# EAGLE design USB_JoystickKeyboarMouse (EAGLE 9.6.2)
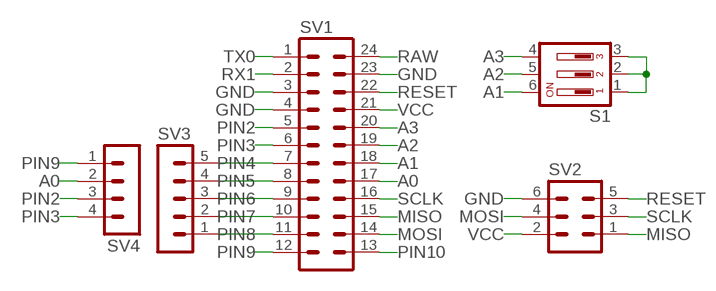
[diagram p0: schematic, sheet 1]

## Parts
S1  DIP03YL  [DIP03YL]
SV1  IC24P  [IC24P]
SV2  MA03-2  [MA03-2]
SV3  MA05-1  [MA05-1]
SV4  MA04-1  [MA04-1]

## Nets
A0: SV1.17 SV4.2
A1: S1.6 SV1.18
A2: S1.5 SV1.19
A3: S1.4 SV1.20
GND: S1.1 S1.2 S1.3 SV1.3 SV1.4 SV1.23 SV2.6
MISO: SV1.15 SV2.1
MOSI: SV1.14 SV2.4
PIN2: SV1.5 SV4.3
PIN3: SV1.6 SV4.4
PIN4: SV1.7 SV3.5
PIN5: SV1.8 SV3.4
PIN6: SV1.9 SV3.3
PIN7: SV1.10 SV3.2
PIN8: SV1.11 SV3.1
PIN9: SV1.12 SV4.1
PIN10: SV1.13
RAW: SV1.24
RESET: SV1.22 SV2.5
RX1: SV1.2
SCLK: SV1.16 SV2.3
TX0: SV1.1
VCC: SV1.21 SV2.2

## Library data of the parts
S1 = switch-dil:DIP03YL: DIL/CODE SWITCH; OC_FARNELL: unknown; OC_NEWARK: unknown
SV1 = con-dil:IC24P: DIL CABLE CONNECTOR
SV2 = con-lstb:MA03-2: PIN HEADER; OC_FARNELL: unknown; OC_NEWARK: unknown
SV3 = con-lstb:MA05-1: PIN HEADER; OC_FARNELL: unknown; OC_NEWARK: unknown
SV4 = con-lstb:MA04-1: PIN HEADER; OC_FARNELL: unknown; OC_NEWARK: unknown

## Board
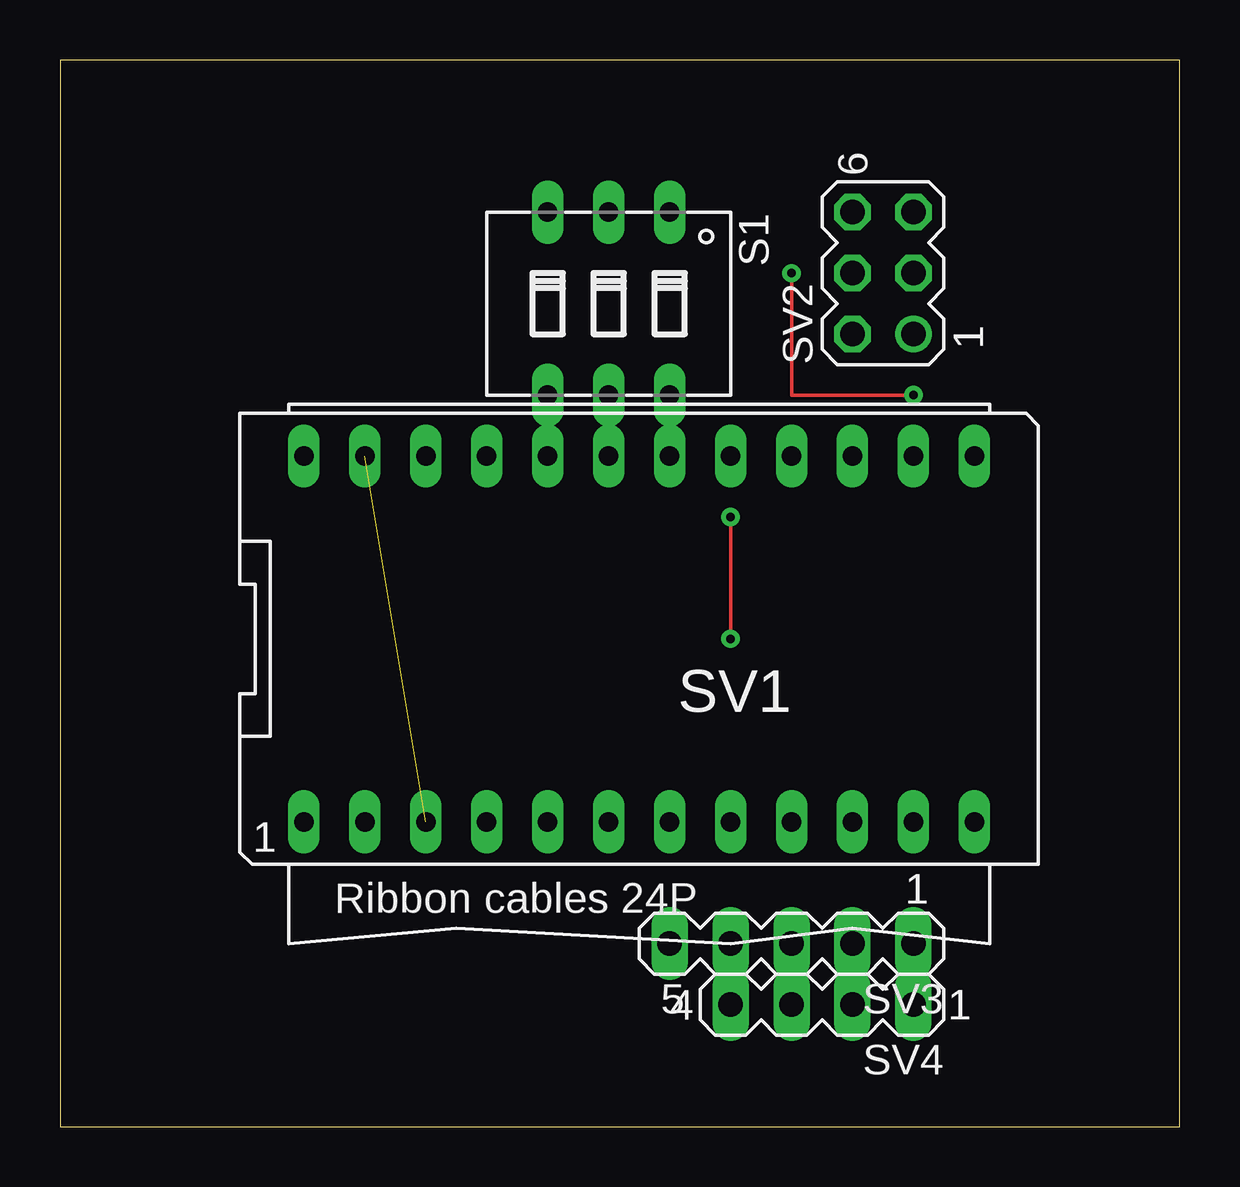
[diagram p1: board, top side]
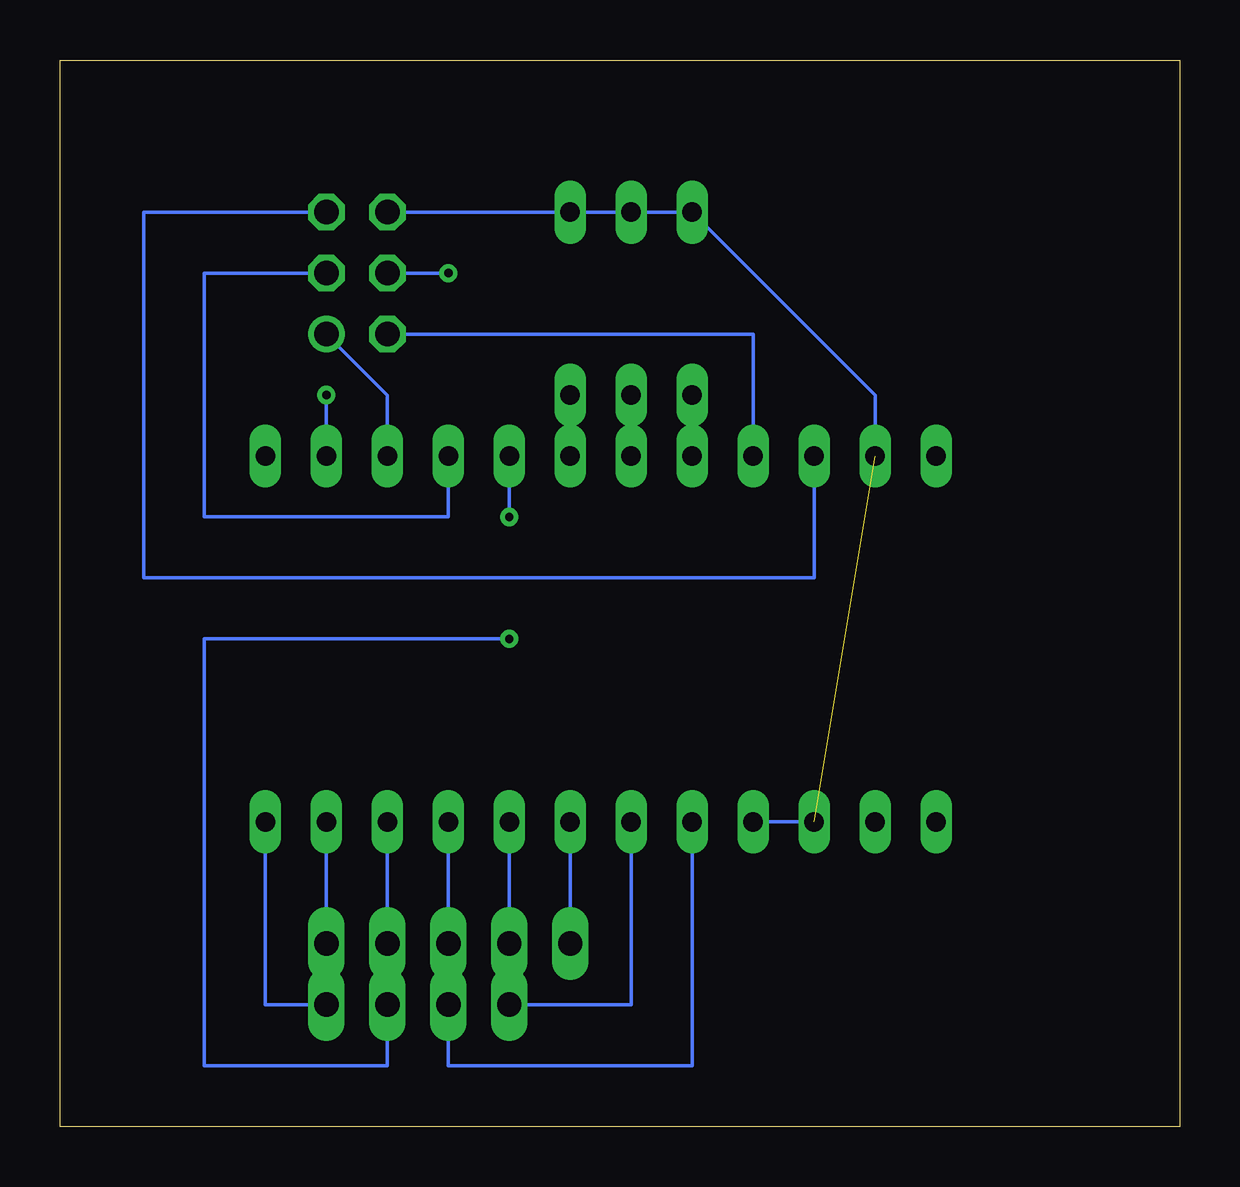
[diagram p2: board, bottom side, seen from below]

Size 46.66 x 44.44 mm. Coordinates in mm from the lower left corner, seen from the top.
Outline: 0,0 46.66,0 46.66,44.44 0,44.44 0,0
Copper layers (1*16): Top 0.035mm / dielectric 1.5mm / Bottom 0.035mm
Design rules "default": minimum track width 6mil, minimum drill 0.35mm, track to track 6mil, track to pad 6mil, pad to pad 6mil, via to via 6mil, smd to smd 6mil, copper to edge 40mil, drill to drill 6mil, minimum pad ring 10mil, minimum via ring 8mil, stop-mask expansion 4mil, vias tented up to drill 0mil, thermal gap 10mil

### Footprints (pad centres in the part's own frame; a part is rotated, then mirrored left to right if it is on the bottom)
DIP03YL = drill 0.813 long: 1 -2.54,-3.81; 2 0,-3.81; 3 2.54,-3.81; 4 2.54,3.81; 5 0,3.81; 6 -2.54,3.81
IC24P = drill 0.813 long: 1 -13.97,-7.62; 2 -11.43,-7.62; 3 -8.89,-7.62; 4 -6.35,-7.62; 5 -3.81,-7.62; 6 -1.27,-7.62; 7 1.27,-7.62; 8 3.81,-7.62; 9 6.35,-7.62; 10 8.89,-7.62; 11 11.43,-7.62; 12 13.97,-7.62; 13 13.97,7.62; 14 11.43,7.62; 15 8.89,7.62; 16 6.35,7.62; 17 3.81,7.62; 18 1.27,7.62; 19 -1.27,7.62; 20 -3.81,7.62; 21 -6.35,7.62; 22 -8.89,7.62; 23 -11.43,7.62; 24 -13.97,7.62
MA03-2 = drill 1.016: 1 -2.54,-1.27 | drill 1.016 octagon: 2 -2.54,1.27; 3 0,-1.27; 4 0,1.27; 5 2.54,-1.27; 6 2.54,1.27
MA05-1 = drill 1.016 long: 1 -5.08,0; 2 -2.54,0; 3 0,0; 4 2.54,0; 5 5.08,0
MA04-1 = drill 1.016 long: 1 -3.81,0; 2 -1.27,0; 3 1.27,0; 4 3.81,0

### Placement (x,y rotation side)
S1  22.86,34.29 180 top
SV1  24.13,20.32 0 top
SV2  34.29,35.56 90 top
SV3  30.48,7.62 180 top
SV4  31.75,5.08 180 top

### Tracks (layer width: path | path; a pad name or v marks a point on that pad's centre or on a via)
A0  (via drill 0.35)
  Top 0.152: v27.94,20.32 v27.94,25.4
  Bottom 0.152: SV4.2 33.02,2.54 40.64,2.54 40.64,20.32 v27.94,20.32 | v27.94,25.4 SV1.17
A1
  Bottom 0.152: S1.6 SV1.18
A2
  Bottom 0.152: S1.5 SV1.19
A3
  Bottom 0.152: S1.4 SV1.20
GND  (1 unrouted)
  Bottom 0.152: SV2.6 S1.1 S1.2 S1.3 12.7,30.48 SV1.23 | SV1.4 SV1.3
MISO
  Bottom 0.152: SV1.15 33.02,30.48 SV2.1
MOSI  (via drill 0.35)
  Top 0.152: v30.48,35.56 30.48,30.48 v35.56,30.48
  Bottom 0.152: SV2.4 v30.48,35.56 | v35.56,30.48 SV1.14
PIN2
  Bottom 0.152: SV1.5 20.32,2.54 30.48,2.54 SV4.3
PIN3
  Bottom 0.152: SV1.6 22.86,5.08 SV4.4
PIN4
  Bottom 0.152: SV1.7 SV3.5
PIN5
  Bottom 0.152: SV1.8 SV3.4
PIN6
  Bottom 0.152: SV1.9 SV3.3
PIN7
  Bottom 0.152: SV1.10 SV3.2
PIN8
  Bottom 0.152: SV1.11 SV3.1
PIN9
  Bottom 0.152: SV4.1 38.1,5.08 SV1.12
RESET
  Bottom 0.152: SV2.5 43.18,38.1 43.18,22.86 15.24,22.86 SV1.22
SCLK
  Bottom 0.152: SV2.3 40.64,35.56 40.64,25.4 30.48,25.4 SV1.16
VCC
  Bottom 0.152: SV2.2 17.78,33.02 SV1.21